# Altium schematic sheet MiniTV.SchDoc
size A; SheetNumber: 1; SheetTotal: 1
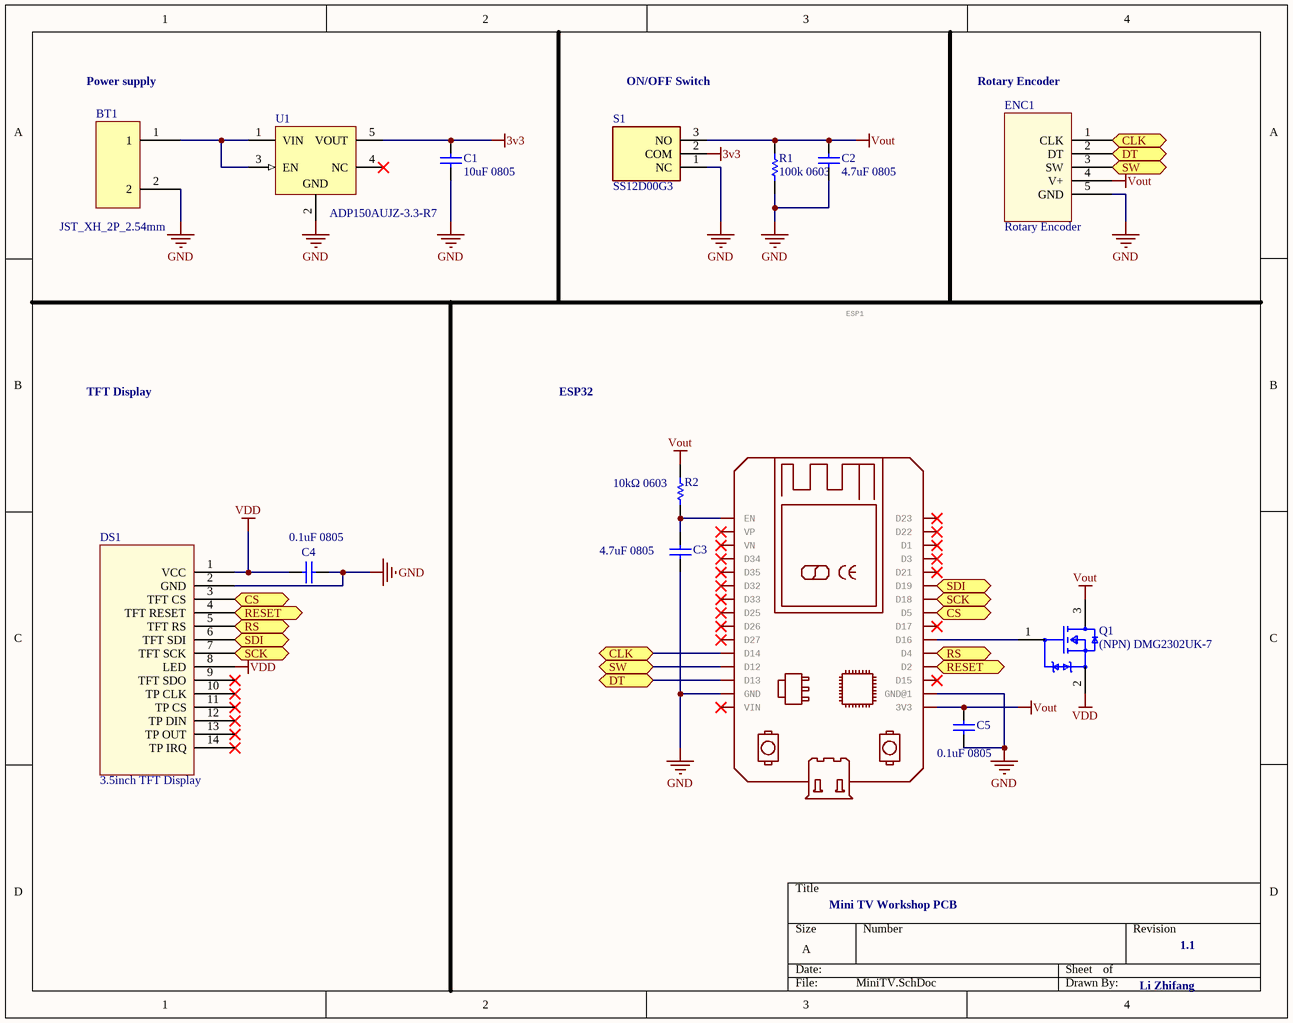
[diagram p0: MiniTV.SchDoc]

## Parts
BT1  JST_XH_2P_2.54mm  [JST_XH_2P_2.54mm]
C1  10uF 0805  [CAPC2013X145X48ML20T23]
C2  4.7uF 0805  [CAPC2013X145X48ML20T23]
C3  4.7uF 0805  [CAPC2013X145X48ML20T23]
C4  0.1uF 0805  [CAPC2013X145X48ML20T23]
C5  0.1uF 0805  [CAPC2013X145X48ML20T23]
DS1  3.5inch TFT Display  [3.5inch SPI Display]
ENC1  Rotary Encoder  [Rotary Encoder]
ESP1  https://github.com/shridattdudhat  [ESP32-DEVKITV1]  (value not drawn)
Q1  (NPN) DMG2302UK-7  [FP-SOT23-MFG]
R1  100k 0603  [RESC1608X55X25ML10T15]
R2  10kΩ 0603  [RESC1608X55X25ML10T15]
S1  SS12D00G3  [SS12D00G3]
U1  ADP150AUJZ-3.3-R7  [ADI-UJ-5_M]

## Ports
CLK (bidir, see MiniTV[2C]), CLK (bidir, see MiniTV[4A]), CS (bidir, see MiniTV[1C]), CS (bidir, see MiniTV[3C]), DT (bidir, see MiniTV[2C]), DT (bidir, see MiniTV[4A]), RESET (bidir, see MiniTV[1C]), RESET (bidir, see MiniTV[3C]), RS (bidir, see MiniTV[1C]), RS (bidir, see MiniTV[3C]), SCK (bidir, see MiniTV[1C]), SCK (bidir, see MiniTV[3C]), SDI (bidir, see MiniTV[1C]), SDI (bidir, see MiniTV[3C]), SW (bidir, see MiniTV[2C]), SW (bidir, see MiniTV[4A])

## Nets
3v3: C1.2 S1.2(COM) U1.5(VOUT)
GND: BT1.2 C1.1 C2.1 C3.2 C4.1 C5.2 DS1.2(GND) ENC1.5(GND) ESP1.GND ESP1.GND@1 R1.2 S1.1(NC) U1.2(GND)
VDD: C4.2 DS1.1(VCC) DS1.8(LED) Q1.2(S)
Vout: C2.2 C5.1 ENC1.4(V+) ESP1.3V3 Q1.3(D) R1.1 R2.1 S1.3(NO)
CLK: ENC1.1(CLK) ESP1.D14 ; port CLK
CS: DS1.3(TFT_CS) ESP1.D5 ; port CS
DT: ENC1.2(DT) ESP1.D13 ; port DT
RESET: DS1.4(TFT_RESET) ESP1.D2 ; port RESET
RS: DS1.5(TFT_RS) ESP1.D4 ; port RS
SCK: DS1.7(TFT_SCK) ESP1.D18 ; port SCK
SDI: DS1.6(TFT_SDI) ESP1.D19 ; port SDI
SW: ENC1.3(SW) ESP1.D12 ; port SW
NetBT1_1: BT1.1 U1.1(VIN) U1.3(EN)
NetC3_1: C3.1 ESP1.EN R2.2
NetESP1_D16: ESP1.D16 Q1.1(G)

Not connected (* = marked no-connect by the designer): DS1 9(TFT_SDO)* 10(TP_CLK)* 11(TP_CS)* 12(TP_DIN)* 13(TP_OUT)* 14(TP_IRQ)*; ESP1 D1* D3* D15* D17* D21* D22* D23* D25* D26* D27* D32* D33* D34* D35* VIN* VN* VP*; U1 4(NC)*

## Notes on the sheet
- Power supply
- ON/OFF Switch
- Rotary Encoder
- TFT Display
- ESP32
- Mini TV Workshop PCB
- Li Zhifang
- 1.1

## Library data of the parts
C1-C5 = CMP-2007-03205-1: Manufacturer: Vitramon; Part Number: VJ0805Y682KXAMT
ESP1 = ESP32DEVKITV1: GateName_1: G$1; SymbolName_1: ESP32-DEVKITV1; LibraryName: ESP32-DEVKITV1; DeviceSetName: ESP32DEVKITV1; Package: ESP32-DEVKITV1
Q1 = CMP-12801-000001-1: MOSFET N-CH 20V 2.8A SOT23; Manufacturer: Diodes Inc.; Reverse Recovery Time: 5.3ns; Gate Charge At Vgs: 2.8nC @ 10V; Turn On Delay Time: 0.6ns; Pulse Drain Current: 12A; Max Forward Diode Voltage: 1.2V; Reverse Recovery Charge: 0.5nC; Automotive Grade: Grade 0; Threshold Vgs Min: 0.3V; Number Of N Channels: 1; Standoff Height: 0.013mm; Typ Forward Diode Voltage: 0.7V; Drain To Source Resistance: 61mΩ; Rthja Max: 192°C/W; Max Junction Temp: +150°C; Input Capacitace At Vds: 130pF @ 10V; Threshold Vgs Max: 1V; Turn Off Delay Time: 4.2ns; Depletion Mode: False; Gate To Source Voltage: 12V; Power Dissipation: 0.66W; Device Class L1: Discrete Semiconductors; Footprint Url: https://www.diodes.com/assets/Package-Files/SOT23.pdf; Lead Free: Yes; Manufacturer Part Number: DMG2302UK-7; Temperature Range High: +150°C; Drain To Source Voltage: 20V; Category: Trans; Digikey Description: MOSFET N-CH 20V 2.8A SOT23; RoHS: TRUE; Device Class L2: Transistors; Height: 1.1mm; Automotive: Yes; Package: SOT23; Drain To Source Breakdown Voltage: 20V; Continuous Drain Current: 2.8A; ComponentLink2Description: Datasheet; Device Class L3: MOSFETs; Octopart: https://octopart.com/dmg2302uk-7-diodes+inc.-73850182; Temperature Range Low: -55°C; Temperature: -55°C to +150°C; Number Of Channels: 1; ComponentLink2URL: https://www.diodes.com/assets/Datasheets/DMG2302UK.pdf
R1 R2 = CMP-2000-04177-1: Part Number: RC0603FR-1020KL; Manufacturer: Yageo
S1 = SS12D00G3: Switch; Manufacturer_Name: Vimex; Datasheet Link: http://vimex.com/switches/techdocs/SS12D00-tech.pdf; Height: 7mm; Manufacturer_Part_Number: SS12D00G3
U1 = CMP-0786-00394-1: Ultralow Noise, 150 mA CMOS Linear Regulator, 2.2 to 5.5 V Vin, 3.3 V Vout, Industrial, 5-pin SOT23 (UJ-5), Reel; Manufacturer: Analog Devices; Supply Current IGND @ Small Load: 10uA; Vin (min) (V): 2.2; Iout max: 150mA; Preset Vout Values (V): 3.3; Vin (max) (V): 5.5; ComponentLink2Description: Datasheet; PackageReference: UJ-5; DatasheetVersion: Rev. A; PackageDescription: 5-Pin Thin Small Outline Transistor Package, Body 2.9 x 1.6 mm, Pitch 0.95 mm; ComponentLink4URL: Product URL:http://www.analog.com/en/ADP150/productSearch.html; Packing: Reel; ComponentLink1URL: http://www.analog.com/en/index.html; PartNumber: ADP150AUJZ-3.3-R7; PackageVersion: 100708-A, 10/2008; ComponentLink3Description: Package Specification; ComponentLink3URL: http:/www.analog.com/static/imported-files/packages/PKG_PDF/TSOT(UJ)/UJ_5.pdf; ComponentLink4Description: URL Link1; ComponentLink2URL: http://www.analog.com/static/imported-files/data_sheets/ADP150.pdf; Code_JEDEC: MO-193-AB; Mounting Technology: Surface Mount; ComponentLink1Description: Manufacturer URL